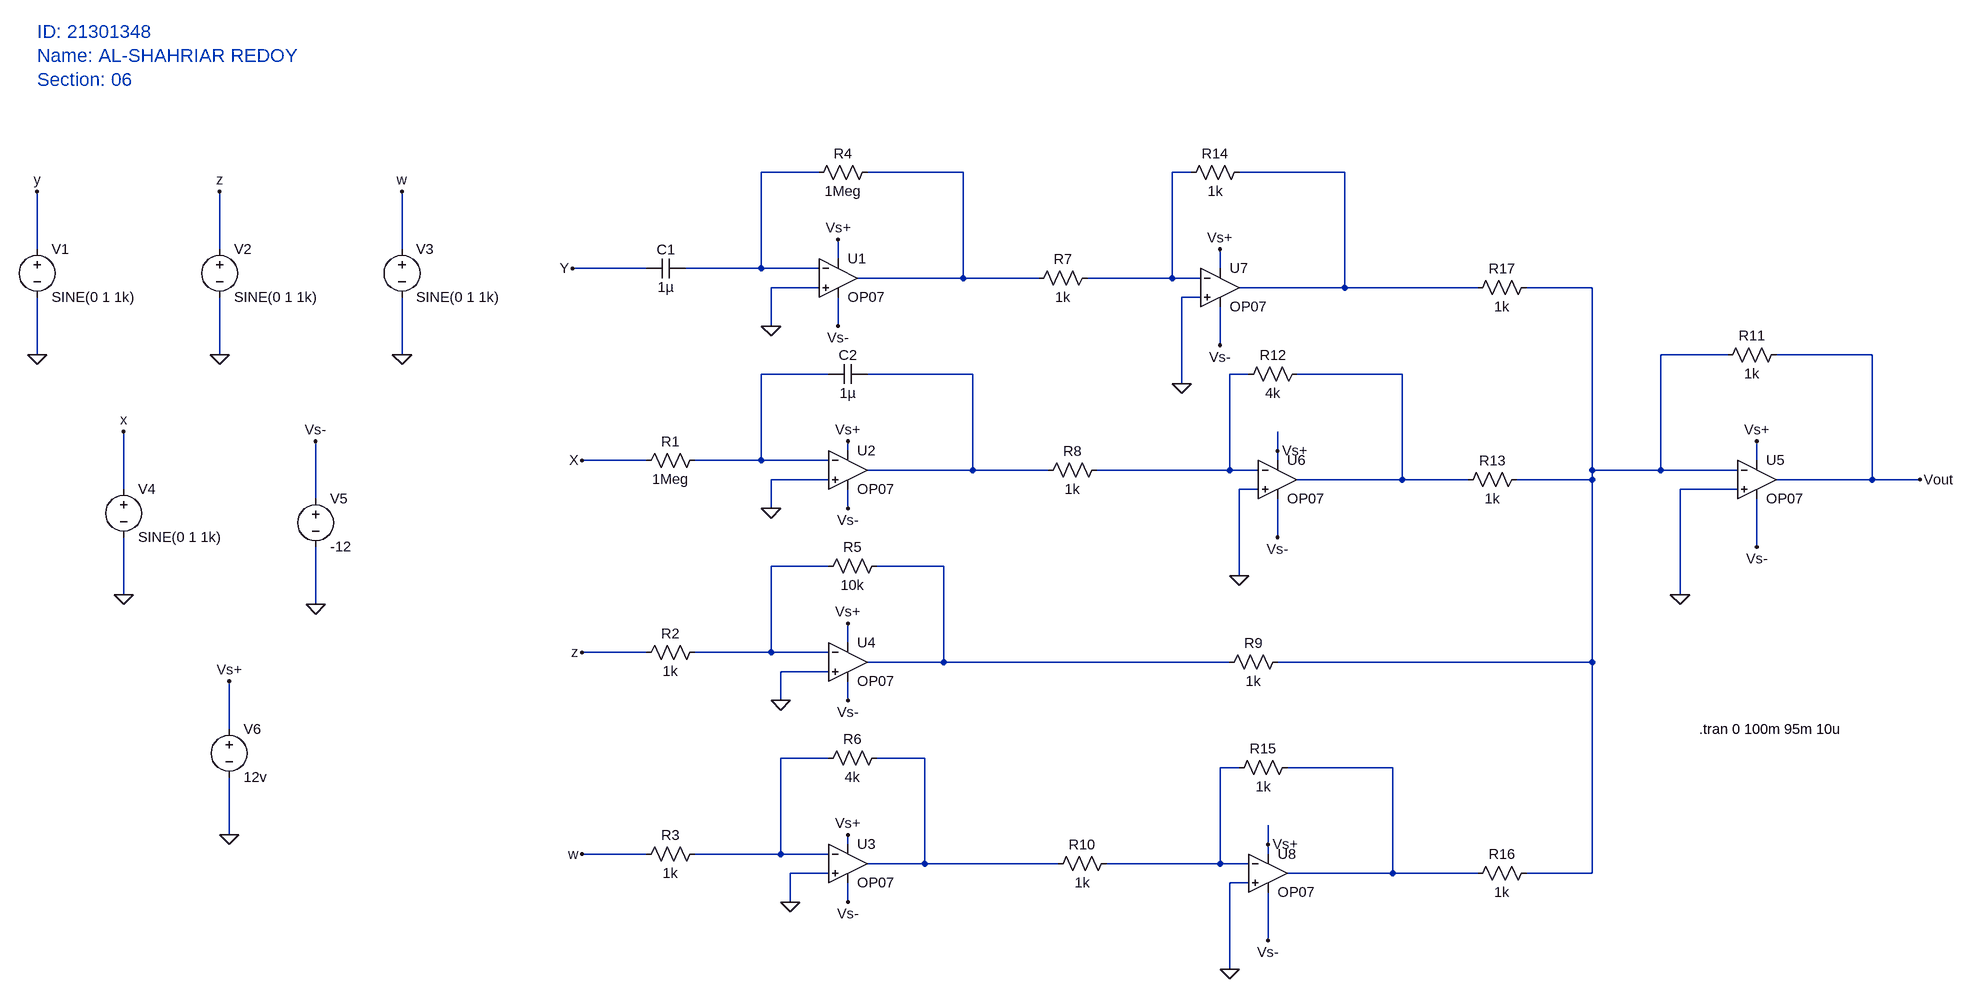
[diagram p0: schematic Project_21301348_Al-Shahriar Redoy.asc]
Project_21301348_Al-Shahriar Redoy.asc, the LTspice schematic file:
Version 4
SHEET 1 2788 1156
WIRE 0 -208 -96 -208
WIRE 240 -208 80 -208
WIRE 672 -208 640 -208
WIRE 928 -208 752 -208
WIRE -1488 -80 -1488 -176
WIRE -1184 -80 -1184 -176
WIRE -880 -80 -880 -176
WIRE 32 -64 32 -96
WIRE -304 -48 -464 -48
WIRE -96 -48 -96 -208
WIRE -96 -48 -240 -48
WIRE 0 -48 -96 -48
WIRE 720 -48 720 -80
WIRE 240 -32 240 -208
WIRE 240 -32 64 -32
WIRE 400 -32 240 -32
WIRE 640 -32 640 -208
WIRE 640 -32 480 -32
WIRE 688 -32 640 -32
WIRE 0 -16 -80 -16
WIRE 928 -16 928 -208
WIRE 928 -16 752 -16
WIRE 1280 -16 928 -16
WIRE 1760 -16 1360 -16
WIRE 688 0 656 0
WIRE -80 48 -80 -16
WIRE 32 48 32 0
WIRE 720 80 720 16
WIRE -1488 96 -1488 0
WIRE -1184 96 -1184 0
WIRE -880 96 -880 0
WIRE 2000 96 1888 96
WIRE 2240 96 2080 96
WIRE 16 128 -96 128
WIRE 256 128 80 128
WIRE 768 128 736 128
WIRE 1024 128 848 128
WIRE 656 144 656 0
WIRE 48 256 48 240
WIRE 816 256 816 224
WIRE -304 272 -448 272
WIRE -96 272 -96 128
WIRE -96 272 -224 272
WIRE 16 272 -96 272
WIRE 816 272 816 256
WIRE 2048 272 2048 240
WIRE 256 288 256 128
WIRE 256 288 80 288
WIRE 416 288 256 288
WIRE 736 288 736 128
WIRE 736 288 496 288
WIRE 784 288 736 288
WIRE 1760 288 1760 -16
WIRE 1888 288 1888 96
WIRE 1888 288 1760 288
WIRE 2016 288 1888 288
WIRE 16 304 -80 304
WIRE 1024 304 1024 128
WIRE 1024 304 848 304
WIRE 1264 304 1024 304
WIRE 1760 304 1760 288
WIRE 1760 304 1344 304
WIRE 2240 304 2240 96
WIRE 2240 304 2080 304
WIRE 2320 304 2240 304
WIRE -1344 320 -1344 224
WIRE 784 320 752 320
WIRE 2016 320 1920 320
WIRE -1024 336 -1024 240
WIRE -80 352 -80 304
WIRE 48 352 48 320
WIRE 816 400 816 336
WIRE 2048 416 2048 336
WIRE 16 448 -80 448
WIRE 208 448 96 448
WIRE 752 464 752 320
WIRE -1344 496 -1344 400
WIRE 1920 496 1920 320
WIRE -1024 512 -1024 416
WIRE 48 576 48 544
WIRE -304 592 -448 592
WIRE -80 592 -80 448
WIRE -80 592 -224 592
WIRE 16 592 -80 592
WIRE 208 608 208 448
WIRE 208 608 80 608
WIRE 736 608 208 608
WIRE 1760 608 1760 304
WIRE 1760 608 816 608
WIRE 16 624 -64 624
WIRE -64 672 -64 624
WIRE 48 672 48 640
WIRE -1168 720 -1168 640
WIRE 16 768 -64 768
WIRE 176 768 96 768
WIRE 752 784 720 784
WIRE 1008 784 832 784
WIRE -1168 896 -1168 800
WIRE 48 912 48 896
WIRE 800 912 800 880
WIRE -304 928 -448 928
WIRE -64 928 -64 768
WIRE -64 928 -224 928
WIRE 16 928 -64 928
WIRE 800 928 800 912
WIRE 176 944 176 768
WIRE 176 944 80 944
WIRE 432 944 176 944
WIRE 720 944 720 784
WIRE 720 944 512 944
WIRE 768 944 720 944
WIRE 16 960 -48 960
WIRE 1008 960 1008 784
WIRE 1008 960 832 960
WIRE 1280 960 1008 960
WIRE 1760 960 1760 608
WIRE 1760 960 1360 960
WIRE 768 976 736 976
WIRE -48 1008 -48 960
WIRE 48 1008 48 976
WIRE 800 1072 800 992
WIRE 736 1120 736 976
FLAG -80 48 0
FLAG -80 352 0
FLAG -64 672 0
FLAG -48 1008 0
FLAG -464 -48 Y
FLAG -448 272 X
FLAG -448 592 z
FLAG -448 928 w
FLAG 1920 496 0
FLAG -1168 896 0
FLAG -1024 512 0
FLAG -1344 496 0
FLAG -1488 96 0
FLAG -1184 96 0
FLAG -880 96 0
FLAG 32 -96 Vs+
FLAG 48 240 Vs+
FLAG 48 544 Vs+
FLAG 48 896 Vs+
FLAG 32 48 Vs-
FLAG 48 352 Vs-
FLAG 48 672 Vs-
FLAG 48 1008 Vs-
FLAG -1168 640 Vs+
FLAG -1024 240 Vs-
FLAG -1344 224 x
FLAG -1488 -176 y
FLAG -1184 -176 z
FLAG -880 -176 w
FLAG 2048 240 Vs+
FLAG 2048 416 Vs-
FLAG 2320 304 Vout
FLAG 752 464 0
FLAG 656 144 0
FLAG 736 1120 0
FLAG 720 -80 Vs+
FLAG 720 80 Vs-
FLAG 816 400 Vs-
FLAG 800 1072 Vs-
FLAG 816 256 Vs+
FLAG 800 912 Vs+
SYMBOL OpAmps\\OP07 32 -96 R0
SYMATTR InstName U1
SYMBOL OpAmps\\OP07 48 224 R0
SYMATTR InstName U2
SYMBOL OpAmps\\OP07 48 880 R0
SYMATTR InstName U3
SYMBOL cap -304 -32 R270
WINDOW 0 32 32 VTop 2
WINDOW 3 0 32 VBottom 2
SYMATTR InstName C1
SYMATTR Value 1µ
SYMBOL res -320 288 R270
WINDOW 0 32 56 VTop 2
WINDOW 3 0 56 VBottom 2
SYMATTR InstName R1
SYMATTR Value 1Meg
SYMBOL res -320 608 R270
WINDOW 0 32 56 VTop 2
WINDOW 3 0 56 VBottom 2
SYMATTR InstName R2
SYMATTR Value 1k
SYMBOL res -320 944 R270
WINDOW 0 32 56 VTop 2
WINDOW 3 0 56 VBottom 2
SYMATTR InstName R3
SYMATTR Value 1k
SYMBOL res -16 -192 R270
WINDOW 0 32 56 VTop 2
WINDOW 3 0 56 VBottom 2
SYMATTR InstName R4
SYMATTR Value 1Meg
SYMBOL res 0 464 R270
WINDOW 0 32 56 VTop 2
WINDOW 3 0 56 VBottom 2
SYMATTR InstName R5
SYMATTR Value 10k
SYMBOL res 0 784 R270
WINDOW 0 32 56 VTop 2
WINDOW 3 0 56 VBottom 2
SYMATTR InstName R6
SYMATTR Value 4k
SYMBOL OpAmps\\OP07 48 544 R0
SYMATTR InstName U4
SYMBOL cap 16 144 R270
WINDOW 0 32 32 VTop 2
WINDOW 3 0 32 VBottom 2
SYMATTR InstName C2
SYMATTR Value 1µ
SYMBOL res 384 -16 R270
WINDOW 0 32 56 VTop 2
WINDOW 3 0 56 VBottom 2
SYMATTR InstName R7
SYMATTR Value 1k
SYMBOL res 400 304 R270
WINDOW 0 32 56 VTop 2
WINDOW 3 0 56 VBottom 2
SYMATTR InstName R8
SYMATTR Value 1k
SYMBOL res 720 624 R270
WINDOW 0 32 56 VTop 2
WINDOW 3 0 56 VBottom 2
SYMATTR InstName R9
SYMATTR Value 1k
SYMBOL res 416 960 R270
WINDOW 0 32 56 VTop 2
WINDOW 3 0 56 VBottom 2
SYMATTR InstName R10
SYMATTR Value 1k
SYMBOL OpAmps\\OP07 2048 240 R0
SYMATTR InstName U5
SYMBOL res 1984 112 R270
WINDOW 0 32 56 VTop 2
WINDOW 3 0 56 VBottom 2
SYMATTR InstName R11
SYMATTR Value 1k
SYMBOL voltage -1488 -96 R0
WINDOW 123 0 0 Left 0
WINDOW 39 0 0 Left 0
SYMATTR InstName V1
SYMATTR Value SINE(0 1 1k)
SYMBOL voltage -1184 -96 R0
WINDOW 123 0 0 Left 0
WINDOW 39 0 0 Left 0
SYMATTR InstName V2
SYMATTR Value SINE(0 1 1k)
SYMBOL voltage -880 -96 R0
WINDOW 123 0 0 Left 0
WINDOW 39 0 0 Left 0
SYMATTR InstName V3
SYMATTR Value SINE(0 1 1k)
SYMBOL voltage -1344 304 R0
WINDOW 123 0 0 Left 0
WINDOW 39 0 0 Left 0
SYMATTR InstName V4
SYMATTR Value SINE(0 1 1k)
SYMBOL voltage -1024 320 R0
WINDOW 123 0 0 Left 0
WINDOW 39 0 0 Left 0
SYMATTR InstName V5
SYMATTR Value -12
SYMBOL voltage -1168 704 R0
WINDOW 123 0 0 Left 0
WINDOW 39 0 0 Left 0
SYMATTR InstName V6
SYMATTR Value 12v
SYMBOL OpAmps\\OP07 816 240 R0
SYMATTR InstName U6
SYMBOL res 864 112 R90
WINDOW 0 0 56 VBottom 2
WINDOW 3 32 56 VTop 2
SYMATTR InstName R12
SYMATTR Value 4k
SYMBOL res 1360 288 R90
WINDOW 0 0 56 VBottom 2
WINDOW 3 32 56 VTop 2
SYMATTR InstName R13
SYMATTR Value 1k
SYMBOL OpAmps\\OP07 720 -80 R0
SYMATTR InstName U7
SYMBOL res 768 -224 R90
WINDOW 0 0 56 VBottom 2
WINDOW 3 32 56 VTop 2
SYMATTR InstName R14
SYMATTR Value 1k
SYMBOL OpAmps\\OP07 800 896 R0
SYMATTR InstName U8
SYMBOL res 848 768 R90
WINDOW 0 0 56 VBottom 2
WINDOW 3 32 56 VTop 2
SYMATTR InstName R15
SYMATTR Value 1k
SYMBOL res 1376 944 R90
WINDOW 0 0 56 VBottom 2
WINDOW 3 32 56 VTop 2
SYMATTR InstName R16
SYMATTR Value 1k
SYMBOL res 1376 -32 R90
WINDOW 0 0 56 VBottom 2
WINDOW 3 32 56 VTop 2
SYMATTR InstName R17
SYMATTR Value 1k
TEXT 1952 720 Left 2 !.tran 0 100m 95m 10u
TEXT -1488 -736 Left 3 ;ID: 21301348
TEXT -1488 -696 Left 3 ;Name: AL-SHAHRIAR REDOY
TEXT -1488 -656 Left 3 ;Section: 06

The netlist it stands for:
* Project_21301348_Al-Shahriar Redoy.asc
XU1 0 N001 Vs+ Vs- N002 LT1001  ; OP07, pins In+ In- V+ V- OUT
XU2 0 N006 Vs+ Vs- N007 LT1001  ; OP07, pins In+ In- V+ V- OUT
XU3 0 N012 Vs+ Vs- N013 LT1001  ; OP07, pins In+ In- V+ V- OUT
C1 Y N001 1µ
R1 X N006 1Meg
R2 z N010 1k
R3 w N012 1k
R4 N001 N002 1Meg
R5 N010 N011 10k
R6 N012 N013 4k
XU4 0 N010 Vs+ Vs- N011 LT1001  ; OP07, pins In+ In- V+ V- OUT
C2 N006 N007 1µ
R7 N002 N003 1k
R8 N007 N008 1k
R9 N011 N005 1k
R10 N013 N014 1k
XU5 0 N005 Vs+ Vs- Vout LT1001  ; OP07, pins In+ In- V+ V- OUT
R11 N005 Vout 1k
V1 Y 0 SINE(0 1 1k)
V2 z 0 SINE(0 1 1k)
V3 w 0 SINE(0 1 1k)
V4 X 0 SINE(0 1 1k)
V5 Vs- 0 -12
V6 Vs+ 0 12v
XU6 0 N008 Vs+ Vs- N009 LT1001  ; OP07, pins In+ In- V+ V- OUT
R12 N009 N008 4k
R13 N005 N009 1k
XU7 0 N003 Vs+ Vs- N004 LT1001  ; OP07, pins In+ In- V+ V- OUT
R14 N004 N003 1k
XU8 0 N014 Vs+ Vs- N015 LT1001  ; OP07, pins In+ In- V+ V- OUT
R15 N015 N014 1k
R16 N005 N015 1k
R17 N005 N004 1k
.tran 0 100m 95m 10u
* ID: 21301348
* Name: AL-SHAHRIAR REDOY
* Section: 06
.lib LTC.lib
.backanno
.end